# Altium schematic sheet clock_contr.SchDoc
size 594 x 420 mm; SheetNumber: 1; SheetTotal: 4
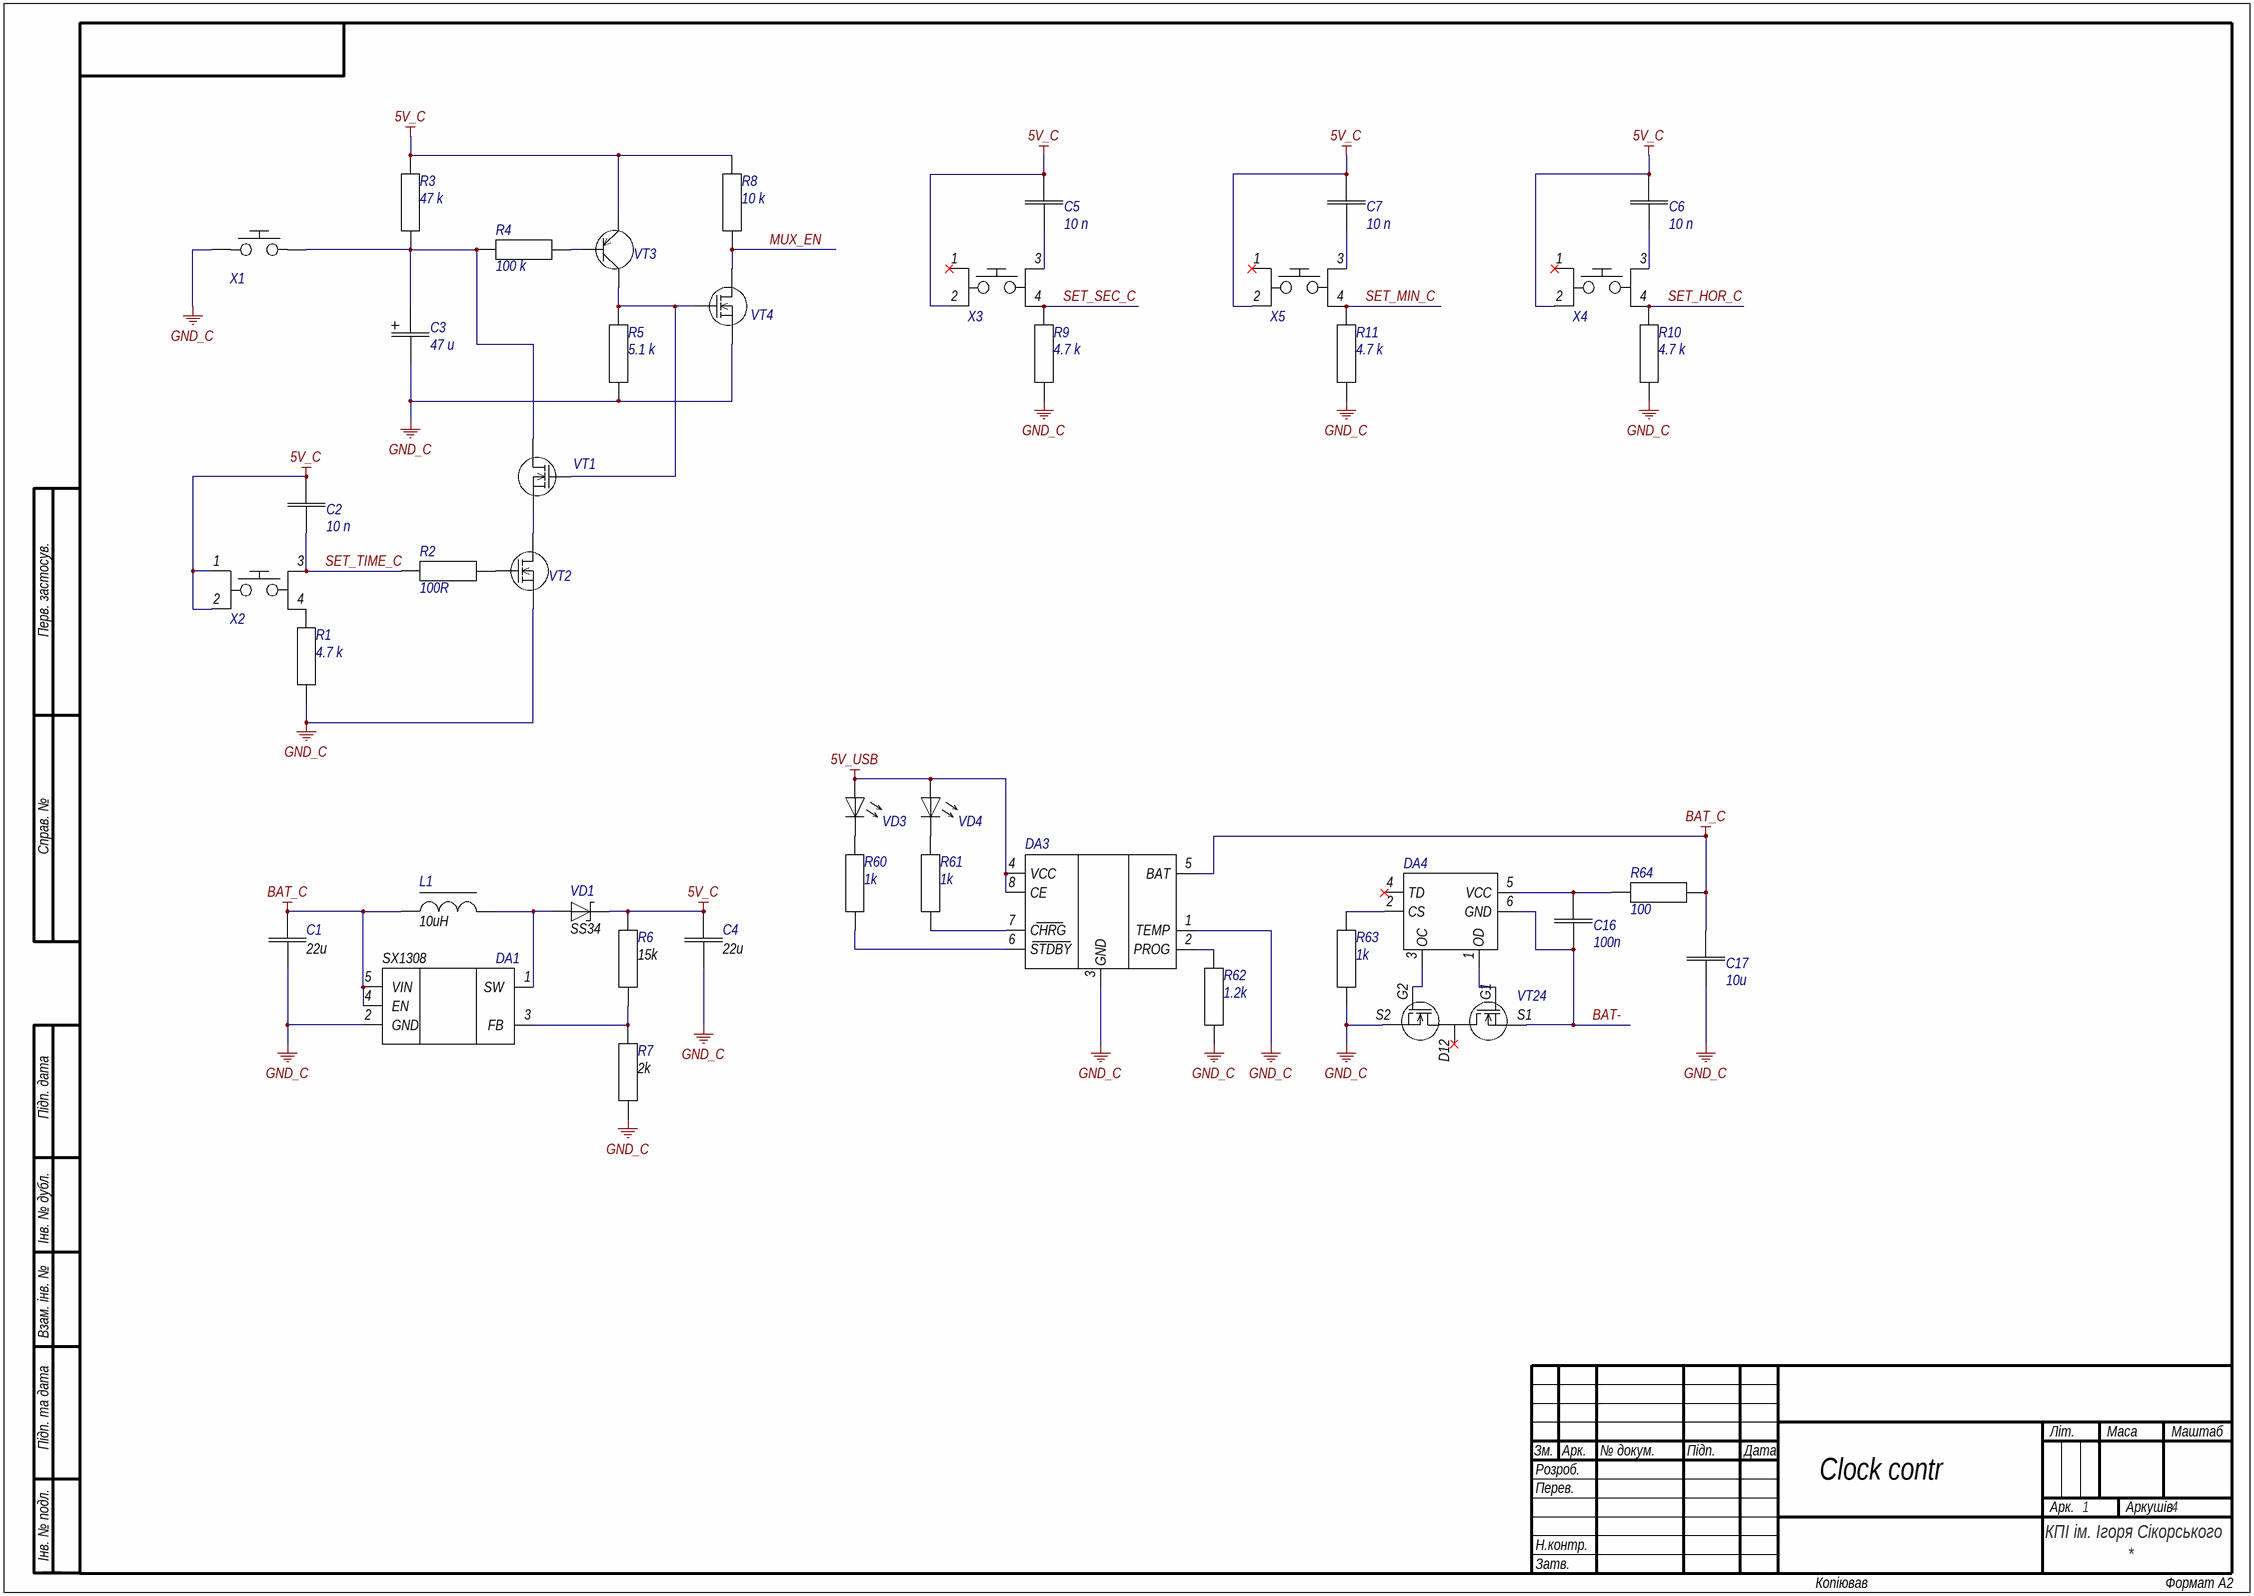
[diagram p0: clock_contr.SchDoc]

## Parts
C1  value 22u  [CAP0805]  (hidden comment: C0805)
C2  value 10 n  [CAP_THT]  (hidden comment: C)
C3  value 47 u  [CAP_POL]  (hidden comment: C+)
C4  value 22u  [CAP0805]  (hidden comment: C0805)
C5  value 10 n  [CAP_THT]  (hidden comment: C)
C6  value 10 n  [CAP_THT]  (hidden comment: C)
C7  value 10 n  [CAP_THT]  (hidden comment: C)
C16  value 100n  [CAP0805]  (hidden comment: C)
C17  value 10u  [CAP0805]  (hidden comment: C)
DA1  SX1308  [SOT23-6]
DA3  TP4056  [SOIC-8]  (value not drawn)
DA4  DW01A  [SOT23-6]  (value not drawn)
L1  value 10uH  [L_SMD]  (hidden comment: L)
R1  value 4.7 k  [RES-DIP]  (hidden comment: R)
R2  value 100R  [RES-DIP]  (hidden comment: R)
R3  value 47 k  [RES-DIP]  (hidden comment: R)
R4  value 100 k  [RES-DIP]  (hidden comment: R)
R5  value 5.1 k  [RES-DIP]  (hidden comment: R)
R6  value 15k  [RES0805]  (hidden comment: R0805)
R7  value 2k  [RES0805]  (hidden comment: R0805)
R8  value 10 k  [RES-DIP]  (hidden comment: R)
R9  value 4.7 k  [RES-DIP]  (hidden comment: R)
R10  value 4.7 k  [RES-DIP]  (hidden comment: R)
R11  value 4.7 k  [RES-DIP]  (hidden comment: R)
R60  value 1k  [RES0805]  (hidden comment: R)
R61  value 1k  [RES0805]  (hidden comment: R)
R62  value 1.2k  [RES0805]  (hidden comment: R)
R63  value 1k  [RES0805]  (hidden comment: R)
R64  value 100  [RES0805]  (hidden comment: R)
VD1  SS34  [DIOM4634X26N]
VD3  LED  [LED_RED]  (value not drawn)
VD4  LED  [LED_RED]  (value not drawn)
VT1  2N7000  [2N7000]  (value not drawn)
VT2  2N7000  [2N7000]  (value not drawn)
VT3  BC327  [BC327]  (value not drawn)
VT4  2N7000  [2N7000]  (value not drawn)
VT24  FS8205 Fortune  [TSSOP8]  (value not drawn)
X1  wake_up_button  [WAKE-UP-BUTTON]  (value not drawn)
X2  button  [button]  (value not drawn)
X3  button  [button]  (value not drawn)
X4  button  [button]  (value not drawn)
X5  button  [button]  (value not drawn)

## Nets
5V_C: C2.2 C4.2 C5.2 C6.2 C7.2 R3.2 R6.2 R8.2 VD1.1(K) VT3.3(E) X2.1 X2.2 X3.2 X4.2 X5.2
5V_USB: DA3.4(VCC) DA3.8(CE) VD3.2(A) VD4.2(A)
BAT_C: C1.2 C17.2 DA1.4(EN) DA1.5(VIN) DA3.5(BAT) L1.1 R64.2
GND_C: C1.1 C3.2 C4.1 C17.1 DA1.2(GND) DA3.1(TEMP) DA3.3(GND) R1.1 R5.1 R7.1 R9.1 R10.1 R11.1 R62.1 R63.1 VT2.1(S) VT4.1(S) VT24.S2 X1.1
BAT-: C16.1 DA4.6(GND) VT24.S1
MUX_EN: R8.1 VT4.3(D)
SET_HOR_C: R10.2 X4.4
SET_MIN_C: R11.2 X5.4
SET_SEC_C: R9.2 X3.4
SET_TIME_C: C2.1 R2.1 X2.3
NetC3_1: C3.1 R3.1 R4.1 VT1.3(D) X1.2
NetC5_1: C5.1 X3.3
NetC6_1: C6.1 X4.3
NetC7_1: C7.1 X5.3
NetC16_2: C16.2 DA4.5(VCC) R64.1
NetDA1_1: DA1.1(SW) L1.2 VD1.2(A)
NetDA1_3: DA1.3(FB) R6.1 R7.2
NetDA3_2: DA3.2(PROG) R62.2
NetDA3_6: DA3.6(STDBY) R60.2
NetDA3_7: DA3.7(CHRG) R61.2
NetDA4_1: DA4.1(OD) VT24.G1
NetDA4_2: DA4.2(CS) R63.2
NetDA4_3: DA4.3(OC) VT24.G2
NetR1_2: R1.2 X2.4
NetR2_2: R2.2 VT2.2(G)
NetR4_2: R4.2 VT3.2(B)
NetR5_2: R5.2 VT1.2(G) VT3.1(C) VT4.2(G)
NetR60_1: R60.1 VD3.1(K)
NetR61_1: R61.1 VD4.1(K)
NetVT1_1: VT1.1(S) VT2.3(D)
NetVT24_5: VT24.5(D12) VT24.D12

Not connected (* = marked no-connect by the designer): DA4 4(TD)*; X3 1*; X4 1*; X5 1*

## Notes on the sheet
- Clock contr
- Перв. застосув.
- Справ. №
- Підп. дата
- Інв. № дубл.
- Взам. інв. №
- Підп. та дата
- Зм.
- Розроб.
- Арк.
- № докум.
- Підп.
- Дата
- Літ.
- Маса
- Маштаб
- Перев.
- Аркушів
- Інв. № подл.
- Н.контр.
- Затв.
- КПІ ім. Ігоря Сікорського
- ALTIUM GOSTBOM2.0 KEV
- Копіював
- Формат А2

## Library data of the parts
VT24 = FS8205: Manufacturer: Fortune; ComponentLink1Description: Datasheet; ComponentLink1URL: https://datasheet.lcsc.com/szlcsc/Fortune-Semicon-FS8205_C32254.pdf; Part Number: FS8205; Value: FS8205
DA1 = SX1308: Name: SX1308
VD1 = SS34: Name: SS34